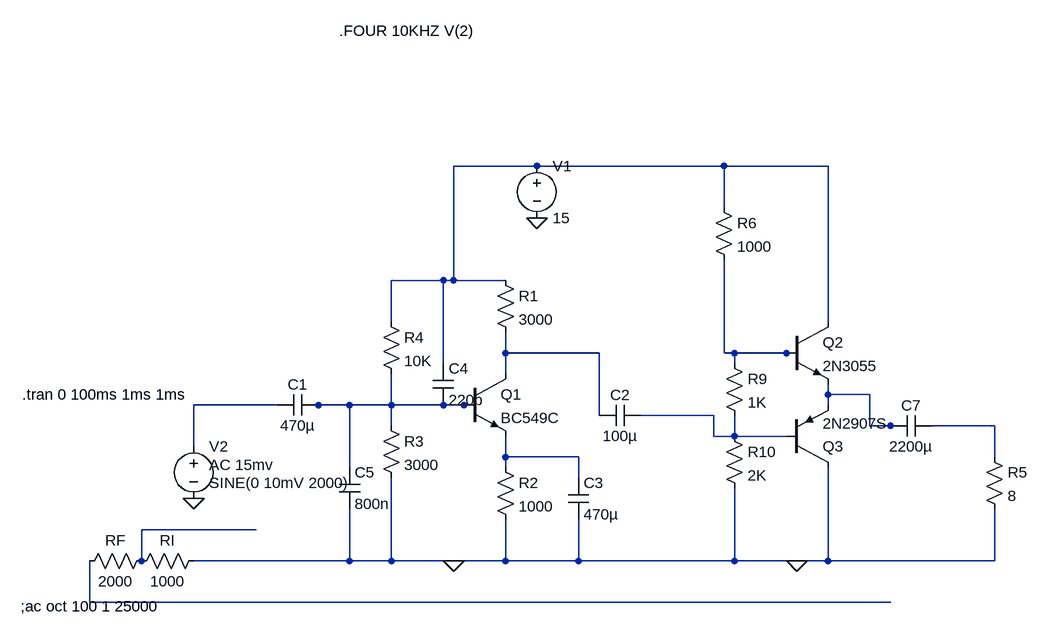
[diagram p0: schematic Awesome 3 - CE BC549 and Tip122 - important fb only AC - push pull.asc]
Awesome 3 - CE BC549 and Tip122 - important fb only AC - push pull.asc, the LTspice schematic file:
Version 4
SHEET 1 1416 680
WIRE -288 -272 -416 -272
WIRE 0 -272 -288 -272
WIRE 160 -272 0 -272
WIRE 0 -208 0 -272
WIRE -432 -96 -512 -96
WIRE -416 -96 -416 -272
WIRE -416 -96 -432 -96
WIRE -336 -96 -416 -96
WIRE -512 -32 -512 -96
WIRE 160 -32 160 -272
WIRE -336 16 -336 -16
WIRE -192 16 -336 16
WIRE 0 16 0 -128
WIRE 16 16 0 16
WIRE 96 16 16 16
WIRE 112 16 96 16
WIRE -432 32 -432 -96
WIRE 16 32 16 16
WIRE -336 48 -336 16
WIRE 160 80 160 64
WIRE 224 80 160 80
WIRE -688 96 -816 96
WIRE -624 96 -640 96
WIRE -576 96 -624 96
WIRE -512 96 -512 48
WIRE -512 96 -576 96
WIRE -432 96 -512 96
WIRE -400 96 -432 96
WIRE -384 96 -400 96
WIRE 160 96 160 80
WIRE -192 112 -192 16
WIRE -16 112 -128 112
WIRE -512 128 -512 96
WIRE 224 128 224 80
WIRE 256 128 224 128
WIRE 272 128 256 128
WIRE 416 128 320 128
WIRE -16 144 -16 112
WIRE 16 144 16 112
WIRE 16 144 -16 144
WIRE 96 144 16 144
WIRE -816 160 -816 96
WIRE -336 176 -336 144
WIRE -224 176 -336 176
WIRE 416 176 416 128
WIRE -576 192 -576 96
WIRE -336 192 -336 176
WIRE -224 208 -224 176
WIRE -720 288 -896 288
WIRE -896 336 -896 288
WIRE -576 336 -576 256
WIRE -576 336 -816 336
WIRE -512 336 -512 208
WIRE -512 336 -576 336
WIRE -416 336 -512 336
WIRE -336 336 -336 272
WIRE -336 336 -416 336
WIRE -224 336 -224 272
WIRE -224 336 -336 336
WIRE 16 336 16 224
WIRE 16 336 -224 336
WIRE 112 336 16 336
WIRE 160 336 160 192
WIRE 160 336 112 336
WIRE 416 336 416 256
WIRE 416 336 160 336
WIRE -976 400 -976 336
WIRE 256 400 -976 400
FLAG -288 -192 0
FLAG -416 336 0
FLAG -816 240 0
FLAG 112 336 0
SYMBOL npn -400 48 R0
SYMATTR InstName Q1
SYMATTR Value BC549C
SYMBOL res -352 -112 R0
SYMATTR InstName R1
SYMATTR Value 3000
SYMBOL voltage -288 -288 R0
WINDOW 123 0 0 Left 2
WINDOW 39 0 0 Left 2
SYMATTR InstName V1
SYMATTR Value 15
SYMBOL res -528 -48 R0
SYMATTR InstName R4
SYMATTR Value 10K
SYMBOL res -528 112 R0
SYMATTR InstName R3
SYMATTR Value 3000
SYMBOL res -352 176 R0
SYMATTR InstName R2
SYMATTR Value 1000
SYMBOL cap -240 208 R0
SYMATTR InstName C3
SYMATTR Value 470µ
SYMBOL cap -624 80 R90
WINDOW 0 0 32 VBottom 2
WINDOW 3 32 32 VTop 2
SYMATTR InstName C1
SYMATTR Value 470µ
SYMBOL voltage -816 144 R0
WINDOW 123 24 44 Left 2
WINDOW 39 0 0 Left 2
WINDOW 3 24 72 Left 2
SYMATTR Value2 AC 15mv
SYMATTR Value SINE(0 10mV 2000)
SYMATTR InstName V2
SYMBOL res -880 320 R90
WINDOW 0 0 56 VBottom 2
WINDOW 3 32 56 VTop 2
SYMATTR InstName RF
SYMATTR Value 2000
SYMBOL res -800 320 R90
WINDOW 0 0 56 VBottom 2
WINDOW 3 32 56 VTop 2
SYMATTR InstName RI
SYMATTR Value 1000
SYMBOL cap -448 32 R0
SYMATTR InstName C4
SYMATTR Value 220p
SYMBOL cap -592 192 R0
SYMATTR InstName C5
SYMATTR Value 800n
SYMBOL npn2 96 -32 R0
SYMATTR InstName Q2
SYMATTR Value 2N3055
SYMBOL res 400 160 R0
SYMATTR InstName R5
SYMATTR Value 8
SYMBOL cap 320 112 R90
WINDOW 0 0 32 VBottom 2
WINDOW 3 32 32 VTop 2
SYMATTR InstName C7
SYMATTR Value 2200µ
SYMBOL pnp 96 192 M180
SYMATTR InstName Q3
SYMATTR Value 2N2907S
SYMBOL res -16 -224 R0
SYMATTR InstName R6
SYMATTR Value 1000
SYMBOL res 0 16 R0
SYMATTR InstName R9
SYMATTR Value 1K
SYMBOL res 0 128 R0
SYMATTR InstName R10
SYMATTR Value 2K
SYMBOL cap -128 96 R90
WINDOW 0 0 32 VBottom 2
WINDOW 3 32 32 VTop 2
SYMATTR InstName C2
SYMATTR Value 100µ
TEXT -1080 80 Left 2 !.tran 0 100ms 1ms 1ms
TEXT -592 -480 Left 2 !.FOUR 10KHZ V(2)
TEXT -1082 406 Left 2 !;ac oct 100 1 25000

The netlist it stands for:
* Awesome 3 - CE BC549 and Tip122 - important fb only AC - push pull.asc
Q1 N002 N006 N009 0 BC549C
R1 N001 N002 3000
V1 N001 0 15
R4 N001 N006 10K
R3 N006 0 3000
R2 N009 0 1000
C3 N009 0 470µ
C1 N006 N005 470µ
V2 N005 0 SINE(0 10mV 2000) AC 15mv
RF N010 N011 2000
RI 0 N010 1000
C4 N001 N006 220p
C5 N006 0 800n
Q2 N001 N003 N004 0 2N3055
R5 N008 0 8
C7 N008 N004 2200µ
Q3 0 N007 N004 0 2N2907S
R6 N001 N003 1000
R9 N003 N007 1K
R10 N007 0 2K
C2 N007 N002 100µ
.model NPN NPN
.model PNP PNP
.lib standard.bjt
.tran 0 100ms 1ms 1ms
.FOUR 10KHZ V(2)
;ac oct 100 1 25000
.backanno
.end